# Altium project PCB_soldeerbout.PrjPcb
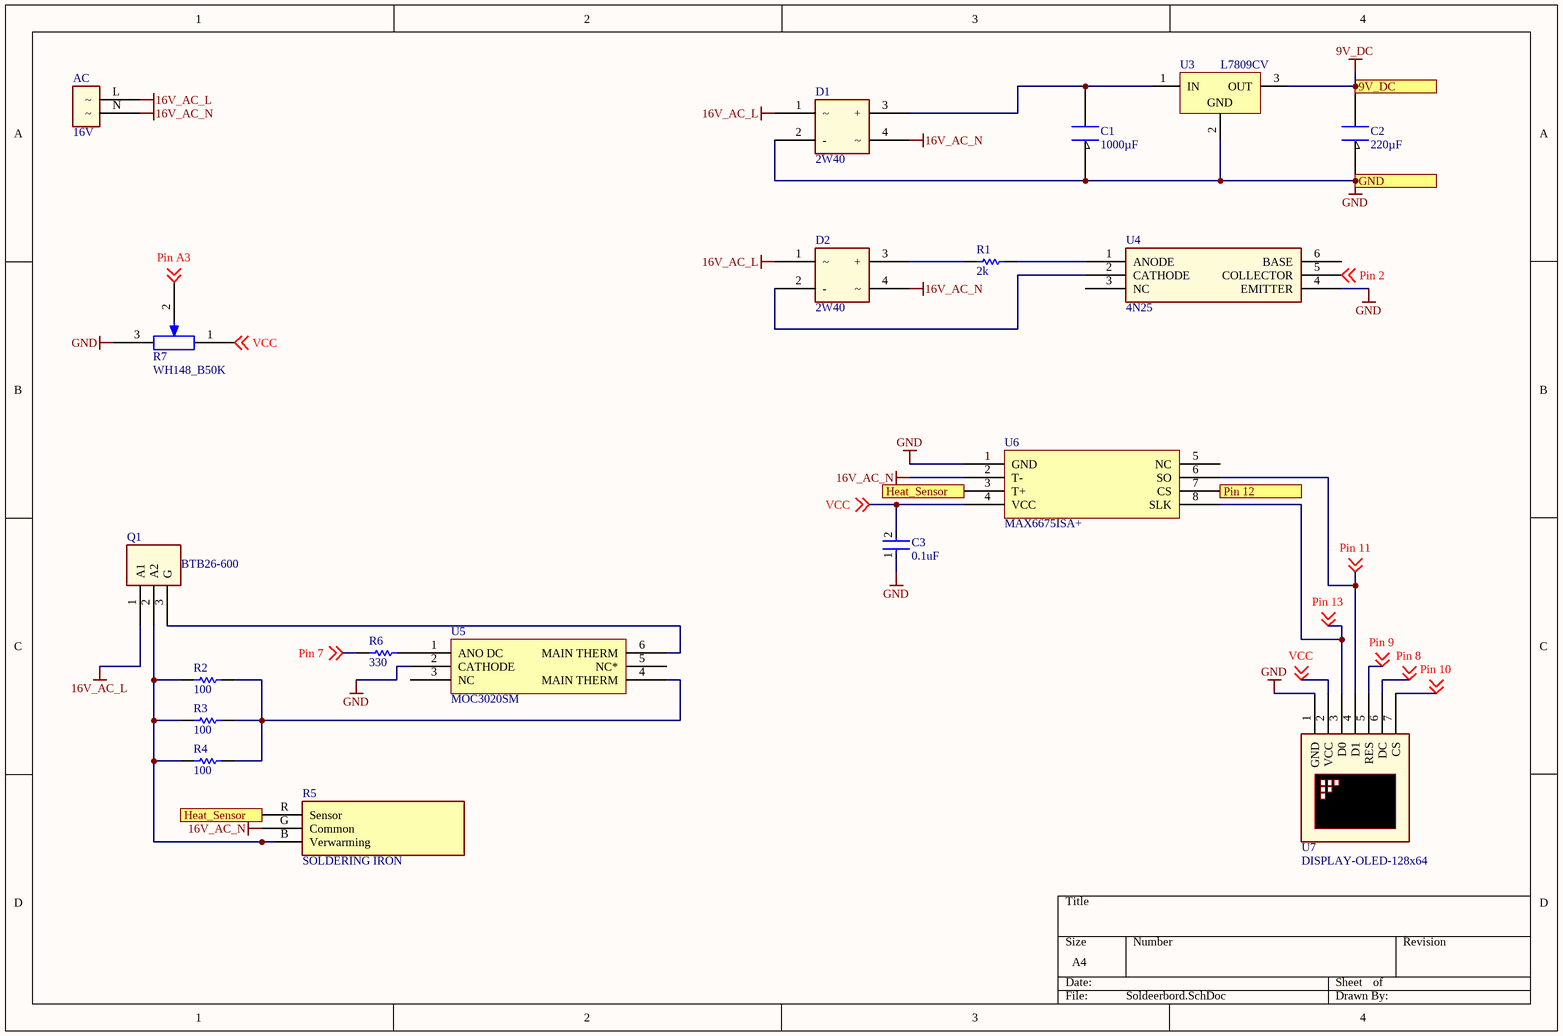
[diagram p0: Soldeerbord.SchDoc]
2 sheets, 38 parts. Net scope: flat (ports and power ports of the same name join across sheets).
Board file: PCB.PcbDoc
Sheets:
  Soldeerbord.SchDoc
  Ardruino_Pro_mini.SchDoc

## Sheet Soldeerbord.SchDoc
size A4; SheetNumber: 1; SheetTotal: 2

### Parts
AC  16V  [PCB_Voeding_16V_AC]
C1  1000µF  [PCB-Capasitor]
C2  220µF  [PCB-Capasitor]
C3  0.1uF  [FP-GRM188-0_1-e0_2_0_55-IPC_A]
D1  2W40  [PCB_2W40]
D2  2W40  [PCB_2W40]
Q1  BTB26-600  [BTB26-600B]
R1  2k  [RESC2013X50X30LL20T20]
R2  100  [RESC2013X50X30LL20T20]
R3  100  [RESC2013X50X30LL20T20]
R4  100  [RESC2013X50X30LL20T20]
R5  SOLDERING IRON  [PCB_Soldering_Iron]
R6  330  [RESC2013X50X30LL20T20]
R7  WH148_B50K  [PCBC_WH148_B50K]
U3  L7809CV  [TO220]
U4  4N25  [4N25-300E]
U5  MOC3020SM  [SOP254P920X508-6N]
U6  MAX6675ISA+  [SOP127P600X175-8N]
U7  DISPLAY-OLED-128x64  [PCB_SPI_OLED_7pin]

### Ports
9V_DC, GND, Heat_Sensor, Pin 12

### Nets
9V_DC: C2.1 U3.3(OUT) ; port 9V_DC
16V_AC_L: AC.L D1.1 D2.1 Q1.1(A1)
16V_AC_N: AC.N D1.4 D2.4 R5.G(Common) U6.2(T-)
GND: C1.2 C2.2 C3.1 D1.2(-) R7.3 U3.2(GND) U4.4(EMITTER) U5.2(CATHODE) U6.1(GND) U7.1(GND) ; port GND
Pin 2: U4.5(COLLECTOR) ; off-sheet Pin 2
Pin 7: R6.1 ; off-sheet Pin 7
Pin 8: U7.6(DC) ; off-sheet Pin 8
Pin 9: U7.5(RES) ; off-sheet Pin 9
Pin 10: U7.7(CS) ; off-sheet Pin 10
Pin 11: U6.6(SO) U7.4(D1) ; off-sheet Pin 11
Pin 13: U6.8(SLK) U7.3(D0) ; off-sheet Pin 13
Pin A3: R7.2 ; off-sheet Pin A3
VCC: C3.2 R7.1 U6.4(VCC) U7.2(VCC) ; off-sheet VCC
NetC1_1: C1.1 D1.3(+) U3.1(IN)
NetD2_2: D2.2(-) U4.2(CATHODE)
NetD2_3: D2.3(+) R1.1
NetQ1_2: Q1.2(A2) R2.1 R3.1 R4.1 R5.B(Verwarming)
NetQ1_3: Q1.3(G) U5.6(MAIN_THERM)
NetR1_2: R1.2 U4.1(ANODE)
NetR2_2: R2.2 R3.2 R4.2 U5.4(MAIN_THERM)
NetR5_R: R5.R(Sensor) U6.3(T+) ; port Heat_Sensor
NetR6_2: R6.2 U5.1(ANO_DC)
NetU1_16: U6.7(CS) ; port Pin 12

Not connected (* = marked no-connect by the designer): U4 3(NC) 6(BASE); U5 3(NC) 5(NC*); U6 5(NC)

### Library data of the parts
AC = Voeding_16V_AC
C1 C2 = Capasitor
C3 = CMP-2006-02792-2: Chip Multilayer Ceramic Capacitors for General Purpose, 0603, 10uF, X5R, 15%, 20%, 6.3V; Packaging: Tape and Reel; Voltage Rating (DC): 6.3V; Width: 0.031inch; Termination: SMD/SMT; Dielectric: X5R; Package Quantity: 4000; Voltage Rating: 6.3V; Capacitance: 10uF; Case/Package: 0603; Min Operating Temperature: -55°C; Voltage: 6.3V; Length: 1.6mm; Thickness: 0.035inch; Lead Free: Lead Free; Depth: 0.8mm; Case Code (Imperial): 0603; Max Operating Temperature: 85°C; Material: Ceramic; Height: 0.8mm; Tolerance: 20%; Mount: Surface Mount; REACH SVHC: No SVHC; Radiation Hardening: No; Case Code (Metric): 1608
Q1 = BTB26-600B
R1-R4 R6 = CMP-2001-04896-1: Manufacturer: Vishay Dale; Part Number: CRCW08050000Z0EA
R5 = Soldering_Iron
U3 = CMP-0244-00424-1: Positive Voltage Regulator, 24V, 3-Pin TO-220; ComponentLink3Description: Package Specification; DatasheetVersion: 16/11/2011; ComponentLink1Description: Manufacturer URL; PackageReference: TO220; ComponentLink2Description: Datasheet; PackageVersion: ver3.0; ComponentLink3URL: http://www.st.com/internet/com/TECHNICAL_RESOURCES/TECHNICAL_LITERATURE/PACKAGE_INFORMATION/CD00004649.pdf; ComponentLink1URL: http://www.st.com; PackageDescription: TO, Thru-Hole, Vertical, Heatsink Mounted; 3 In-Line Leads; Pitch 2.54 mm; ComponentLink2URL: http://www.st.com/internet/com/TECHNICAL_RESOURCES/TECHNICAL_LITERATURE/DATASHEET/CD00000444.pdf
U4 = 4N25-300E
U7 = SPI_OLED_7Pin

## Sheet Ardruino_Pro_mini.SchDoc
size A4; SheetNumber: 2; SheetTotal: 2
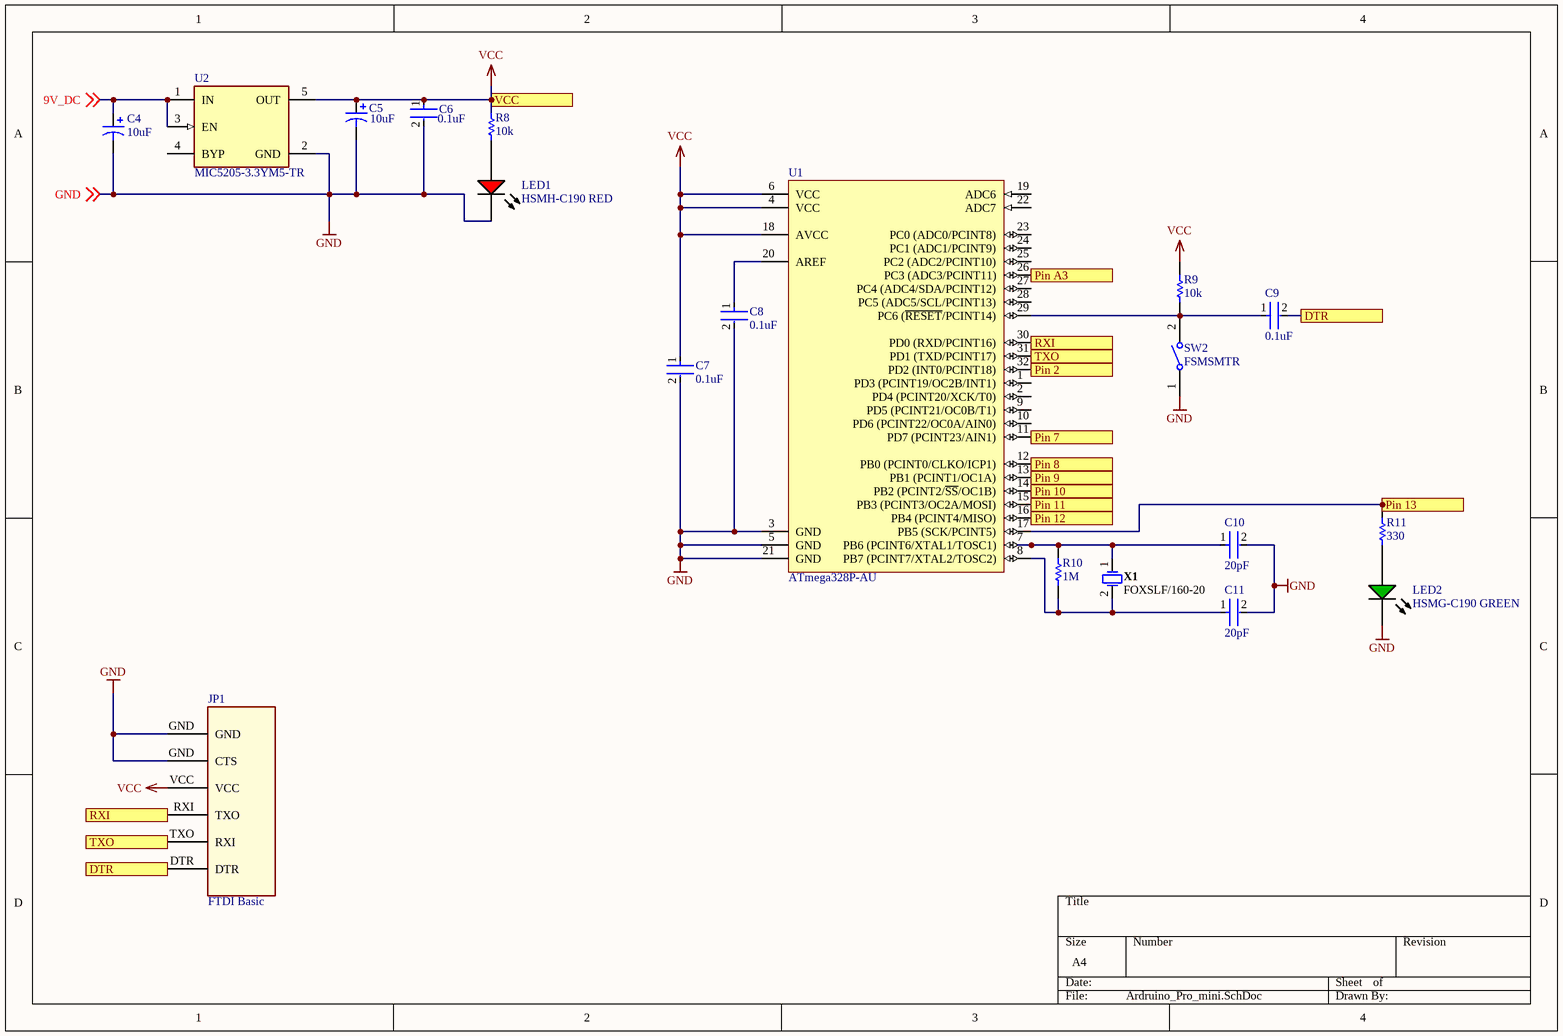
[diagram p1: Ardruino_Pro_mini.SchDoc]

### Parts
C4  value 10uF  [C0805]
C5  value 10uF  [C0805]
C6  0.1uF  [FP-GRM188-0_1-e0_2_0_55-IPC_A]
C7  0.1uF  [FP-GRM188-0_1-e0_2_0_55-IPC_A]
C8  0.1uF  [FP-GRM188-0_1-e0_2_0_55-IPC_A]
C9  0.1uF  [FP-GRM188-0_1-e0_2_0_55-IPC_A]
C10  20pF  [FP-GRM188-0_1-e0_2_0_55-IPC_A]
C11  20pF  [FP-GRM188-0_1-e0_2_0_55-IPC_A]
JP1  FTDI Basic  [PCB_ProgrammingPor]
LED1  HSMH-C190 RED  [AVAG-HSMX-C190_V]
LED2  HSMG-C190 GREEN  [AVAG-HSMX-C190_V]
R8  10k  [RESC2013X50X30LL20T20]
R9  10k  [RESC2013X50X30LL20T20]
R10  1M  [RESC2013X50X30LL20T20]
R11  330  [RESC2013X50X30LL20T20]
SW2  FSMSMTR  [TECO-FSMSMTR_V]
U1  ATmega328P-AU  [32A_M]
U2  MIC5205-3.3YM5-TR  [FP-M5-MFG]
X1  FOXSLF/160-20  [FOX-FOXSLF160-20]

### Ports
DTR, Pin 2, Pin 7, Pin 8, Pin 9, Pin 10, Pin 11, Pin 12, Pin 13, Pin A3, RXI, TXO, VCC

### Nets
GND: C4.2 C5.2 C6.2 C7.2 C8.2 C10.2 C11.2 JP1.GND LED1.2(K) LED2.2(K) SW2.1 U1.3(GND) U1.5(GND) U1.21(GND) U2.2(GND) ; off-sheet GND
VCC: C5.1 C6.1 C7.1 JP1.VCC R8.2 R9.2 U1.4(VCC) U1.6(VCC) U1.18(AVCC) U2.5(OUT) ; port VCC
9V_DC: C4.1 U2.1(IN) U2.3(EN) ; off-sheet 9V_DC
NetC8_1: C8.1 U1.20(AREF)
NetC9_1: C9.1 R9.1 SW2.2 U1.29(PC6_(~{RESET}/PCINT14))
NetC9_2: C9.2 JP1.DTR ; port DTR
NetC10_1: C10.1 R10.2 U1.7(PB6_(PCINT6/XTAL1/TOSC1)) X1.1
NetC11_1: C11.1 R10.1 U1.8(PB7_(PCINT7/XTAL2/TOSC2)) X1.2
NetJP1_RXI: JP1.RXI(TXO) U1.30(PD0_(RXD/PCINT16)) ; port RXI
NetJP1_TXO: JP1.TXO(RXI) U1.31(PD1_(TXD/PCINT17)) ; port TXO
NetLED1_1: LED1.1(A) R8.1
NetLED2_1: LED2.1(A) R11.1
NetR11_2: R11.2 U1.17(PB5_(SCK/PCINT5)) ; port Pin 13
NetU1_11: U1.11(PD7_(PCINT23/AIN1)) ; port Pin 7
NetU1_12: U1.12(PB0_(PCINT0/CLKO/ICP1)) ; port Pin 8
NetU1_13: U1.13(PB1_(PCINT1/OC1A)) ; port Pin 9
NetU1_14: U1.14(PB2_(PCINT2/~{SS}/OC1B)) ; port Pin 10
NetU1_15: U1.15(PB3_(PCINT3/OC2A/MOSI)) ; port Pin 11
NetU1_16: U1.16(PB4_(PCINT4/MISO)) ; port Pin 12
NetU1_26: U1.26(PC3_(ADC3/PCINT11)) ; port Pin A3
NetU1_32: U1.32(PD2_(INT0/PCINT18)) ; port Pin 2

Not connected (* = marked no-connect by the designer): U1 1(PD3_(PCINT19/OC2B/INT1)) 2(PD4_(PCINT20/XCK/T0)) 9(PD5_(PCINT21/OC0B/T1)) 10(PD6_(PCINT22/OC0A/AIN0)) 19(ADC6) 22(ADC7) 23(PC0_(ADC0/PCINT8)) 24(PC1_(ADC1/PCINT9)) 25(PC2_(ADC2/PCINT10)) 27(PC4_(ADC4/SDA/PCINT12)) 28(PC5_(ADC5/SCL/PCINT13)); U2 4(BYP)

### Library data of the parts
C4 C5 = Cap Pol3: Polarized Capacitor (Surface Mount); Published: 8-Jun-2000; LatestRevisionDate: 29-May-2009; LatestRevisionNote: IPC-7351 Footprint Added.; PackageReference: C0805; Publisher: Altium Limited; PackageDescription: Chip Capacitor
C6-C11 = CMP-2006-02792-2: as C3 on sheet Soldeerbord; Packaging: Tape and Reel; Voltage Rating (DC): 6.3V; Width: 0.031inch; Termination: SMD/SMT; Dielectric: X5R; Package Quantity: 4000; Voltage Rating: 6.3V; Case/Package: 0603; Min Operating Temperature: -55°C; Voltage: 6.3V; Length: 1.6mm; Thickness: 0.035inch; Lead Free: Lead Free; Depth: 0.8mm; Case Code (Imperial): 0603; Max Operating Temperature: 85°C; Material: Ceramic; Height: 0.8mm; Tolerance: 20%; Mount: Surface Mount; REACH SVHC: No SVHC; Radiation Hardening: No; Case Code (Metric): 1608
  C6: Capacitance: 0.1uF
  C7-C11: Capacitance: 10uF
JP1 = ProgrammingPort
LED1 = CMP-1744-00004-1: LED Uni-Color Red, 65 mW, 20 mA, -40 to 85 degC, 2-Pin SMD, RoHS, Tape and Reel; Connector Type: USB; Gender: Male; Current Rating: 1 A; Length: 7.5 mm; Lead Pitch: 0.65 mm; PackageReference: HSMX-C190; Package Quantity: 2000; Max Operating Temperature: 85 degC; PackageDescription: 2-Pin Surface Mount Device, Body 1.6 x 0.8 mm, Height 0.9 mm; ComponentLink3Description: Package Specification; Mount: Surface Mount; Min Operating Temperature: -30 degC; ComponentLink3URL: http://www.fairchildsemi.com/dwg/MA/MA03D.pdf; ComponentLink1Description: Manufacturer URL; Contact Material: Copper; Pins: 5; Width: 5.6 mm; ComponentLink2Description: Datasheet; RoHSCompliant: true; DatasheetVersion: Mar-12; Height: 2.8 mm; Packaging: Tape and Reel; Contact Plating: Gold; ComponentLink1URL: http://www.avagotech.com/; REACH SVHC: No SVHC; ComponentLink2URL: http://docs.avagotech.com/docs/AV02-0551EN
LED2 = CMP-1744-00002-1: Chip LED, Green, 2.2 V, -40 to 85 degC, 2-Pin SMD, RoHS, Tape and Reel; Frequency: 400 KHz; Max Supply Voltage: 5.5 V; Access Time: 3500 ns; Clock Frequency: 100 KHz; Case\Package: SOIC; Density: 32 kb; Nominal Supply Current: 2 mA; Interface: Serial; Min Supply Voltage: 1.7 V; Packaging: Tape and Reel; PackageReference: HSMX-C190; ComponentLink2URL: http://docs.avagotech.com/docs/AV02-0551EN; RoHSCompliant: true; Pins: 8; REACH SVHC: No SVHC; Max Operating Temperature: 85 degC; Width: 4 mm; Radiation Hardening: No; Package Quantity: 3000; ComponentLink3Description: Package Specification; ComponentLink1Description: Manufacturer URL; Min Operating Temperature: -40 degC; PackageDescription: 2-Pin Surface Mount Device, Body 1.6 x 0.8 mm, Height 0.9 mm; Max Clock Frequency: 100 KHz; Height: 1.5 mm; ComponentLink1URL: http://www.avagotech.com/; DatasheetVersion: Mar-12; ComponentLink2Description: Datasheet; Mount: Surface Mount; Length: 5 mm; ComponentLink3URL: http://www.fairchildsemi.com/dwg/MA/MA03D.pdf
R8-R11 = CMP-2001-04896-1: as R1 on sheet Soldeerbord
SW2 = CMP-2000-07501-1: FSMSM Push Button Switch, 50 mA, -35 to 85 degC, 2-Pin SMD, RoHS, Tape and Reel; Manufacturer: TE Connectivity; Voltage Rating (DC): 24V; Electrical Life: 20000Cycles; Operating Force: 180gf; Switch Travel: 0.25mm; Contact Current Rating: 50mA; Case\/Package: SMD/SMT; Actuator Length: 1.07mm; Throw Configuration: SPST; Actuator Material: Polyamide; Contact Resistance: 100mOhm; Illumination Type: Illuminated; Max Voltage Rating (DC): 12V; Manufacturer URL: http://www.te.com/; Lead Free: LeadFree; Packaging: TapeandReel; Min Operating Temperature: -35degC; Mechanical Life: 20000Cycles; Mount: SurfaceMount; REACH SVHC: Unknown; Package Quantity: 1800; Package Reference: FSMSMTR; RoHSCompliant: true; Max Operating Temperature: 85degC; Orientation: Straight; ELV: Compliant; Datasheet URL: http://www.te.com/commerce/DocumentDelivery/DDEController?Action=showdoc&DocId=Customer+Drawing%7F1437566-3%7FC2%7Fpdf%7FEnglish%7FENG_CD_1437566-3_C2_1437566_3_1_c.dwg.pdf%7F1437566-4; Package Description: 2-Pin Surface Mount Device, Body 6 x 3.5 mm, Pitch 9.19 mm; Current Rating: 50mA; Contact Plating: Silver; Termination: GullWing; Datasheet Version: Rev. C2, 08/2014; Contact Material: Brass; Mounting Technology: SurfaceMount
U1 = CMP-0095-00269-2: 8-bit AVR Microcontroller, 32KB Flash, 1KB EEPROM, 2KB SRAM, 32-pin TQFP, Industrial Grade (-40°C to 85°C); PackageDescription: 32-Lead, 7x7x1.0 mm Body, 0.8mm Lead Pitch, Thin Profile Plastic Quad Flat Package (TQFP); DatasheetVersion: revD, May-2011; RevisionNote: DatasheetVersion & PackageVersion updated. URLs added.; ComponentLink1URL: http://www.atmel.com/; ComponentLink2Description: ATmega48A/48PA/88A/88PA/168A/168PA/328/328P Datasheet; Code_JEDEC: MS-026-ABA; ComponentLink1Description: Manufacturer URL; PackageReference: 32A; ComponentLink3Description: ATmega48A/48PA/88A/88PA/168A/168PA/328/328P Summary; ComponentLink2URL: http://www.atmel.com/dyn/resources/prod_documents/doc8271.pdf; PackageVersion: revC, Oct-2010; ComponentLink3URL: http://www.atmel.com/dyn/resources/prod_documents/8271S.pdf
U2 = CMP-06324-000014-1: IC REG LINEAR 3.3V 150MA SOT23-5; Manufacturer: Microchip; Number Of Outputs: 1; Output Type: Fixed; Min Supply Voltage: 2.5V; Accuracy Percentage: 2%; Dropout Voltage: 165mV; Max Supply Voltage: 16V; Max Junction Temp: +125°C; Standoff Height: 0mm; Digikey Description: IC REG LINEAR 3.3V 150MA SOT23-5; Output Current: 150mA; Temperature: -40°C to +125°C; Temperature Range High: +125°C; Height: 1.45mm; ComponentLink2URL: http://ww1.microchip.com/downloads/en/DeviceDoc/20005785A.pdf; Mouser Description: LDO Voltage Regulators; Device Class L3: Voltage Regulators - Linear; Package: M5; Temperature Range Low: -40°C; Device Class L1: Integrated Circuits (ICs); ComponentLink2Description: Datasheet; Automotive: No; Ipc Land Pattern Name: SOT95P280X118-5; Octopart: https://octopart.com/mic5205-3.3ym5-tr-microchip-66802130; Device Class L2: Power Management ICs; Manufacturer Part Number: MIC5205-3.3YM5-TR; Lead Free: Yes; RoHS: TRUE
X1 = CMP-1749-00003-1: Resistance Weld Thru-Hole Crystal, 16 MHz, -20 to 70 degC, 2-Pin THD, RoHS, Bulk; Voltage Rating: 250 V; Tolerance: 1%; Resistance: 221 kohm; Case\Package: Axial; Power Rating: 250 mW; RoHSCompliant: true; Package Quantity: 200; Packaging: Bulk; Min Operating Temperature: -55 degC; DatasheetVersion: Mar-15; ComponentLink1URL: http://www.foxonline.com/; Max Operating Temperature: 155 degC; PackageReference: FOXSLF160-20; Mount: Through Hole; PackageDescription: 2-Pin Through Hole Device, Body 11.35 x 4.65 mm; ComponentLink1Description: Manufacturer URL; ComponentLink2URL: http://www.foxonline.com/pdfs/hc49slf.pdf; ComponentLink2Description: Datasheet; Length: 0.248 inch

## Nets that join several sheets
GND: Soldeerbord (10 pins), Ardruino_Pro_mini (15 pins)
NetU1_16: Soldeerbord (U6.7), Ardruino_Pro_mini (U1.16)